# EAGLE schematic Motion (EAGLE 9.5.2)
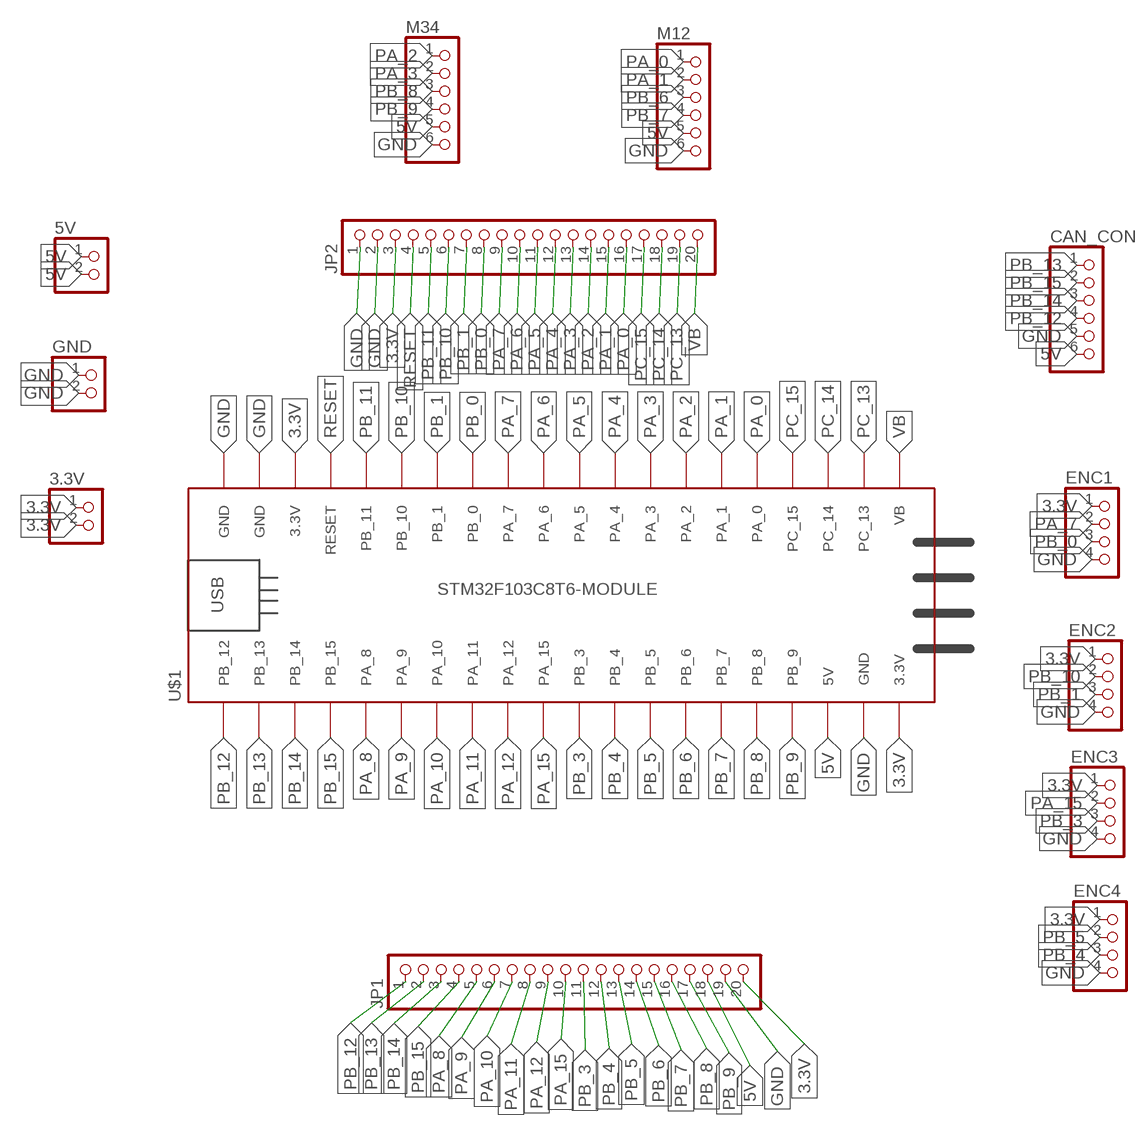
[diagram p0: schematic, sheet 1]

## Parts
3.3V  PINHD-2_DATA  [1X02_DATA]
5V  PINHD-2_DATA  [1X02_DATA]
CAN_CON  PINHD-6_DATA  [1X06_DATA]
ENC1  PINHD-4_DATA  [1X04_DATA]
ENC2  PINHD-4_DATA  [1X04_DATA]
ENC3  PINHD-4_DATA  [1X04_DATA]
ENC4  PINHD-4_DATA  [1X04_DATA]
GND  PINHD-2_DATA  [1X02_DATA]
JP1  PINHD-1X20  [1X20]
JP2  PINHD-1X20  [1X20]
M12  PINHD-1X6  [1X06]
M34  PINHD-1X6  [1X06]
U$1  STM32F103C8T6-MODULE  [STM32F103C8T6-MODULE]

## Nets
3.3V: 3.3V.1 3.3V.2 ENC1.1 ENC2.1 ENC3.1 ENC4.1 JP1.20 JP2.3 U$1.3.3V_1(3.3V) U$1.3.3V_2(3.3V)
5V: 5V.1 5V.2 CAN_CON.6 JP1.18 M12.5 M34.5 U$1.5V
GND: CAN_CON.5 ENC1.4 ENC2.4 ENC3.4 ENC4.4 GND.1 GND.2 JP1.19 JP2.1 JP2.2 M12.6 M34.6 U$1.GND_1(GND) U$1.GND_2(GND) U$1.GND_3(GND)
PA_0: JP2.16 M12.1 U$1.PA_0
PA_1: JP2.15 M12.2 U$1.PA_1
PA_2: JP2.14 M34.1 U$1.PA_2
PA_3: JP2.13 M34.2 U$1.PA_3
PA_4: JP2.12 U$1.PA_4
PA_5: JP2.11 U$1.PA_5
PA_6: JP2.10 U$1.PA_6
PA_7: ENC1.2 JP2.9 U$1.PA_7
PA_8: JP1.5 U$1.PA_8
PA_9: JP1.6 U$1.PA_9
PA_10: JP1.7 U$1.PA_10
PA_11: JP1.8 U$1.PA_11
PA_12: JP1.9 U$1.PA_12
PA_15: ENC3.2 JP1.10 U$1.PA_15
PB_0: ENC1.3 JP2.8 U$1.PB_0
PB_1: ENC2.3 JP2.7 U$1.PB_1
PB_3: ENC3.3 JP1.11 U$1.PB_3
PB_4: ENC4.3 JP1.12 U$1.PB_4
PB_5: ENC4.2 JP1.13 U$1.PB_5
PB_6: JP1.14 M12.3 U$1.PB_6
PB_7: JP1.15 M12.4 U$1.PB_7
PB_8: JP1.16 M34.3 U$1.PB_8
PB_9: JP1.17 M34.4 U$1.PB_9
PB_10: ENC2.2 JP2.6 U$1.PB_10
PB_11: JP2.5 U$1.PB_11
PB_12: CAN_CON.4 JP1.1 U$1.PB_12
PB_13: CAN_CON.1 JP1.2 U$1.PB_13
PB_14: CAN_CON.3 JP1.3 U$1.PB_14
PB_15: CAN_CON.2 JP1.4 U$1.PB_15
PC_13: JP2.19 U$1.PC_13
PC_14: JP2.18 U$1.PC_14
PC_15: JP2.17 U$1.PC_15
RESET: JP2.4 U$1.RESET
VB: JP2.20 U$1.VB

## Library data of the parts
3.3V 5V GND = MIA_LIBRARY-2-2-2:PINHD-2_DATA: PIN HEADER
CAN_CON = MIA_LIBRARY-2-2-2:PINHD-6_DATA: PIN HEADER
ENC1-ENC4 = MIA_LIBRARY-2-2-2:PINHD-4_DATA: PIN HEADER
JP1 JP2 = MIA_LIBRARY-2-2-2:PINHD-1X20: PIN HEADER
M12 M34 = MIA_LIBRARY-2-2-2:PINHD-1X6: PIN HEADER
U$1 = MIA_LIBRARY-2-2-2:STM32F103C8T6-MODULE: STM32F103C8T6 module with ARM Cortex-3, 20kB SRAM, 64kB Flash, 72MHz